# EAGLE design 3x_74HC595 (EAGLE 6.3)
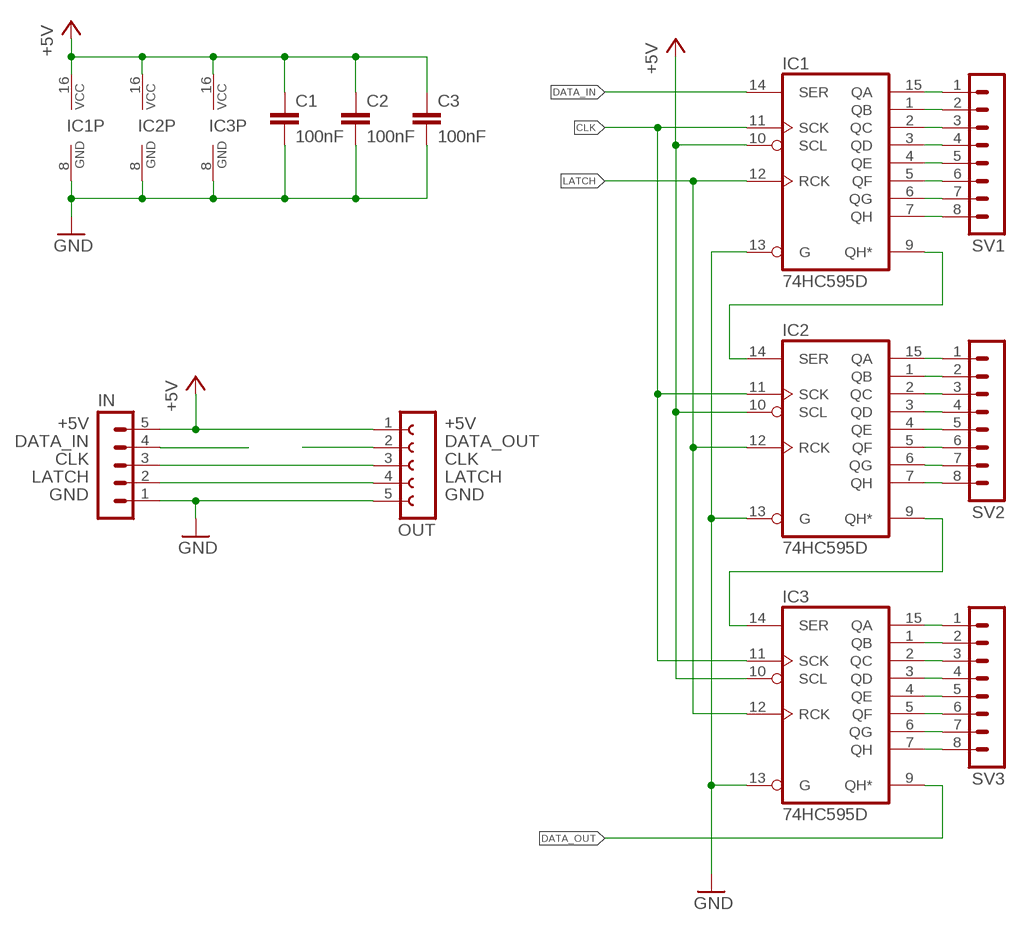
[diagram p0: schematic, sheet 1]

## Parts
C1  100nF  C-EUC1206  [C1206]
C2  100nF  C-EUC1206  [C1206]
C3  100nF  C-EUC1206  [C1206]
IC1  74HC595D  [SO16]
IC2  74HC595D  [SO16]
IC3  74HC595D  [SO16]
IN  MA05-1W  [MA05-1W]
OUT  FE05W  [FE05W]
SV1  MA08-1W  [MA08-1W]
SV2  MA08-1W  [MA08-1W]
SV3  MA08-1W  [MA08-1W]

## Nets
1QA: IC1.15(QA) SV1.1
1QB: IC1.1(QB) SV1.2
1QC: IC1.2(QC) SV1.3
1QD: IC1.3(QD) SV1.4
1QE: IC1.4(QE) SV1.5
1QF: IC1.5(QF) SV1.6
1QG: IC1.6(QG) SV1.7
1QH: IC1.7(QH) SV1.8
1SHIFTOUT: IC1.9(QH*) IC2.14(SER)
2QA: IC2.15(QA) SV2.1
2QB: IC2.1(QB) SV2.2
2QC: IC2.2(QC) SV2.3
2QD: IC2.3(QD) SV2.4
2QE: IC2.4(QE) SV2.5
2QF: IC2.5(QF) SV2.6
2QG: IC2.6(QG) SV2.7
2QH: IC2.7(QH) SV2.8
2SHIFTOUT: IC2.9(QH*) IC3.14(SER)
3QA: IC3.15(QA) SV3.1
3QB: IC3.1(QB) SV3.2
3QC: IC3.2(QC) SV3.3
3QD: IC3.3(QD) SV3.4
3QE: IC3.4(QE) SV3.5
3QF: IC3.5(QF) SV3.6
3QG: IC3.6(QG) SV3.7
3QH: IC3.7(QH) SV3.8
+5V: C1.1 C2.1 C3.1 IC1.10(SCL) IC1.16(VCC) IC2.10(SCL) IC2.16(VCC) IC3.10(SCL) IC3.16(VCC) IN.5 OUT.1
CLK: IC1.11(SCK) IC2.11(SCK) IC3.11(SCK) IN.3 OUT.3
DATA_IN: IC1.14(SER) IN.4
DATA_OUT: IC3.9(QH*) OUT.2
GND: C1.2 C2.2 C3.2 IC1.8(GND) IC1.13(G) IC2.8(GND) IC2.13(G) IC3.8(GND) IC3.13(G) IN.1 OUT.5
LATCH: IC1.12(RCK) IC2.12(RCK) IC3.12(RCK) IN.2 OUT.4

## Notes on the sheet
- +5V | +5V
- DATA_IN | DATA_OUT
- CLK | CLK
- LATCH | LATCH
- GND | GND

## Library data of the parts
C1-C3 = rcl:C-EU: CAPACITOR, European symbol
IC1-IC3 = 74xx-eu:74*595: 8-bit SHIFT REGISTER, output latch
IN = con-lstb:MA05-1W
OUT = con-lsta:FE05W: FEMALE HEADER; OC_FARNELL: unknown; OC_NEWARK: unknown
SV1-SV3 = con-lstb:MA08-1W: PIN HEADER; OC_FARNELL: unknown; OC_NEWARK: unknown

## Board
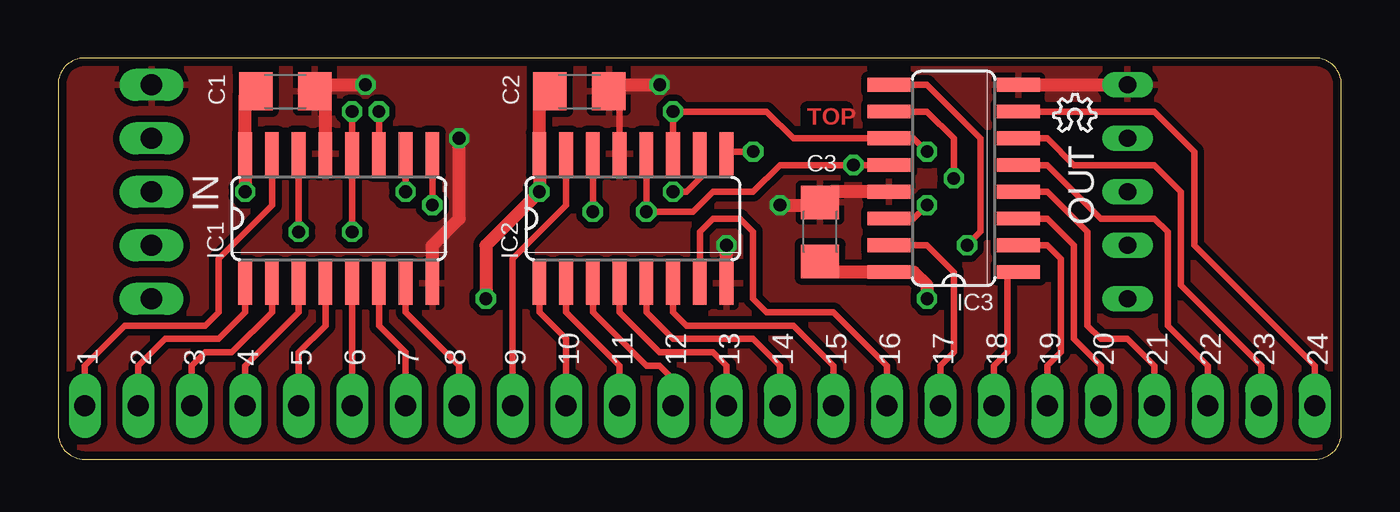
[diagram p1: board, top side]
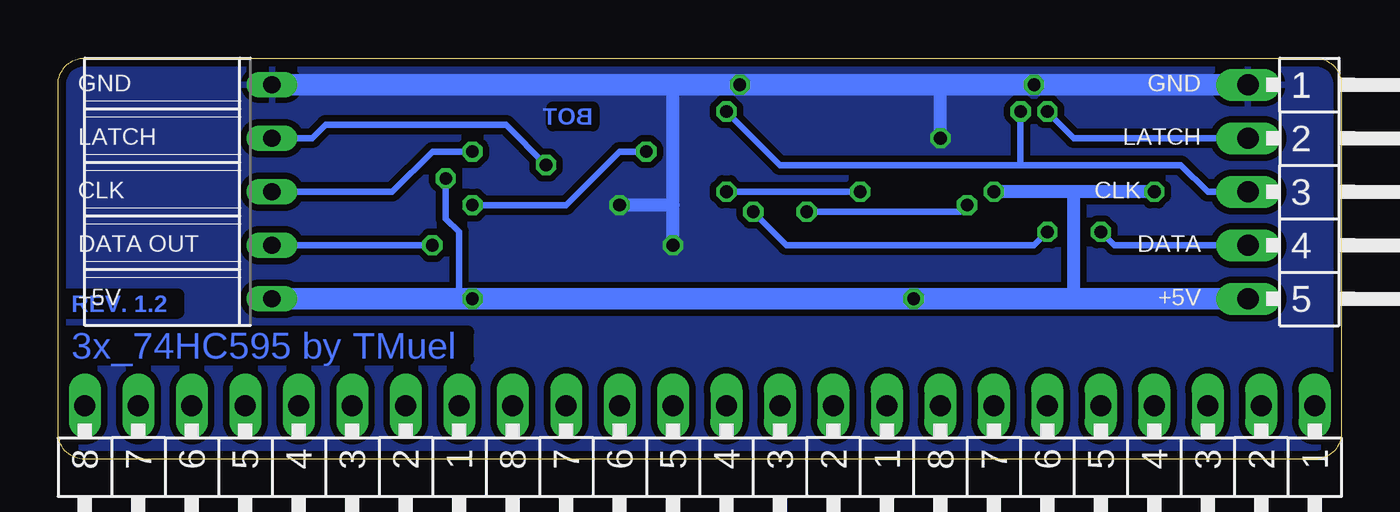
[diagram p2: board, bottom side, seen from below]

Size 60.96 x 19.05 mm. Coordinates in mm from the lower left corner, seen from the top.
Outline: 0,17.78 0,1.27 arc90 1.27,0 59.69,0 arc90 60.96,1.27 60.96,17.78 arc90 59.69,19.05 1.27,19.05 arc90 0,17.78
Copper layers (1*16): Top 0.0356mm / dielectric 1.5011mm / Bottom 0.0356mm
Design rules "LaenPCBOrder": minimum track width 6mil, minimum drill 13mil, track to track 6mil, track to pad 6mil, pad to pad 6mil, via to via 6mil, smd to smd 6mil, copper to edge 15mil, drill to drill 6mil, minimum pad ring 7mil, minimum via ring 7mil, stop-mask expansion 3mil, vias tented up to drill 0mil, thermal gap 10mil

### Footprints (pad centres in the part's own frame; a part is rotated, then mirrored left to right if it is on the bottom)
C1206 = smd 1.6 x 1.8: 1 -1.4,0; 2 1.4,0
SO16 = smd 0.66 x 2.032: 1 -4.445,-3.073; 2 -3.175,-3.073; 3 -1.905,-3.073; 4 -0.635,-3.073; 5 0.635,-3.073; 6 1.905,-3.073; 7 3.175,-3.073; 8 4.445,-3.073; 9 4.445,3.073; 10 3.175,3.073; 11 1.905,3.073; 12 0.635,3.073; 13 -0.635,3.073; 14 -1.905,3.073; 15 -3.175,3.073; 16 -4.445,3.073
MA05-1W = drill 1.016 long: 1 -5.08,0; 2 -2.54,0; 3 0,0; 4 2.54,0; 5 5.08,0
FE05W = drill 0.813 long: 1 -5.08,0; 2 -2.54,0; 3 0,0; 4 2.54,0; 5 5.08,0
MA08-1W = drill 1.016 long: 1 -8.89,0; 2 -6.35,0; 3 -3.81,0; 4 -1.27,0; 5 1.27,0; 6 3.81,0; 7 6.35,0; 8 8.89,0

### Placement (x,y rotation side)
C1  10.79,17.46 0 top
C2  24.77,17.46 0 top
C3  36.2,10.79 90 top
IC1  13.34,11.43 0 top
IC2  27.3,11.43 0 top
IC3  42.55,13.34 90 top
IN  4.45,12.7 270 bottom
OUT  50.8,12.7 90 bottom
SV1  10.16,2.54 180 bottom
SV2  30.48,2.54 180 bottom
SV3  50.8,2.54 180 bottom
U$1  [OSHW_6X70_NOTEXT]  47.31,15.56 0 top

### Tracks (layer width: path | path; a pad name or v marks a point on that pad's centre or on a via)
1QA
  Top 0.305: IC1.15 10.16,12.06 7.62,9.53 7.62,6.99 6.99,6.35 3.17,6.35 1.27,4.45 SV1.1
1QB
  Top 0.305: IC1.1 8.89,6.99 7.62,5.71 5.08,5.71 3.81,4.45 SV1.2
1QC
  Top 0.305: IC1.2 10.16,6.99 8.26,5.08 6.99,5.08 6.35,4.45 SV1.3
1QD
  Top 0.305: IC1.3 11.43,6.99 8.89,4.45 SV1.4
1QE
  Top 0.305: IC1.4 12.7,6.35 11.43,5.08 SV1.5
1QF
  Top 0.305: IC1.5 SV1.6
1QG
  Top 0.305: SV1.7 16.51,5.08 15.24,6.35 IC1.6
1QH
  Top 0.305: IC1.7 16.51,6.99 19.05,4.45 SV1.8
1SHIFTOUT  (via drill 0.6)
  Top 0.305: IC2.14 v25.4,11.75 | v17.78,12.06 IC1.9
  Bottom 0.305: v25.4,11.75 18.1,11.75 v17.78,12.06
2QA
  Top 0.305: IC2.15 24.13,12.06 21.59,9.53 SV2.1
2QB
  Top 0.305: SV2.2 24.13,5.71 22.86,6.99 IC2.1
2QC
  Top 0.305: SV2.3 26.67,4.45 24.13,6.99 IC2.2
2QD
  Top 0.305: SV2.4 29.21,3.81 28.57,4.45 27.94,4.45 25.4,6.99 IC2.3
2QE
  Top 0.305: SV2.5 31.75,4.45 31.11,5.08 28.57,5.08 26.67,6.99 IC2.4
2QF
  Top 0.305: SV2.6 34.29,4.45 33.02,5.71 29.21,5.71 27.94,6.99 IC2.5
2QG
  Top 0.305: SV2.7 36.83,4.45 34.92,6.35 29.84,6.35 29.21,6.99 IC2.6
2QH
  Top 0.305: IC2.7 30.48,10.79 31.11,11.43 32.38,11.43 33.02,10.79 33.02,7.62 33.66,6.99 36.83,6.99 39.37,4.45 SV2.8
2SHIFTOUT  (via drill 0.6)
  Top 0.305: IC3.14 40.64,11.43 v41.27,12.06 | v33.02,14.61 31.75,14.61 IC2.9
  Bottom 0.305: v41.27,12.06 36.83,12.06 34.29,14.61 v33.02,14.61
3QA
  Top 0.305: SV3.1 41.91,4.45 42.55,5.08 42.55,8.89 41.27,10.16 IC3.15
3QB
  Top 0.305: 45.72,8.89 IC3.1 45.09,8.89 45.09,5.08 44.45,4.45 SV3.2
3QC
  Top 0.305: SV3.3 46.99,4.45 47.62,5.08 47.62,9.53 46.99,10.16 IC3.2
3QD
  Top 0.305: SV3.4 49.53,4.45 48.26,5.71 48.26,10.16 46.99,11.43 IC3.3
3QE
  Top 0.305: SV3.5 52.07,4.45 50.8,5.71 49.53,5.71 48.9,6.35 48.9,10.79 46.99,12.7 IC3.4
3QF
  Top 0.305: SV3.6 54.61,4.45 52.7,6.35 52.7,10.79 52.07,11.43 49.53,11.43 46.99,13.97 IC3.5
3QG
  Top 0.305: SV3.7 57.15,4.45 53.34,8.26 53.34,12.7 52.07,13.97 48.26,13.97 46.99,15.24 IC3.6
3QH
  Top 0.305: SV3.8 59.69,4.45 53.98,10.16 53.98,14.61 52.07,16.51 IC3.7
+5V  (via drill 0.6)
  Top 0.305: IC1.10 v16.51,12.7 | IC2.10 30.48,13.34 29.84,12.7 v29.21,12.7 | 36.7,8.89 C3.1 | 8.89,17.27 C1.1 | 22.86,17.27 C2.1 | v42.55,13.34 42.55,15.24 41.27,16.51 IC3.10 39.37,16.51
  Top 0.61: v8.89,12.7 IC1.16 8.89,17.27 | 36.7,8.89 IC3.16 40.64,8.89 41.27,8.26 v41.27,7.62 | 22.86,17.27 IC2.16 v22.86,12.7 20.32,10.16 v20.32,7.62
  Bottom 0.305: v29.21,12.7 v22.86,12.7 | v42.55,13.34 42.55,11.43 41.91,10.79 41.91,7.62
  Bottom 0.61: v8.89,12.7 12.7,12.7 | 12.7,12.7 v16.51,12.7 | 12.7,7.62 12.7,12.7
  Bottom 1.016: OUT.1 41.91,7.62 v41.27,7.62 v20.32,7.62 12.7,7.62 IN.5
CLK  (via drill 0.6)
  Top 0.305: IC1.11 v15.24,16.51 | IC2.11 v29.21,16.51 33.66,16.51 34.92,15.24 IC3.11 40.64,15.24 v41.27,14.61
  Bottom 0.305: 15.24,13.97 26.67,13.97 v29.21,16.51 | IN.3 6.35,12.7 7.62,13.97 15.24,13.97 | 15.24,13.97 v15.24,16.51 | OUT.3 45.09,12.7 43.18,14.61 v41.27,14.61
DATA_IN  (via drill 0.6)
  Top 0.305: IC1.14 v11.43,10.79
  Bottom 0.305: v11.43,10.79 10.79,10.16 IN.4
DATA_OUT  (via drill 0.6)
  Top 0.305: IC3.9 41.27,17.78 43.81,15.24 43.81,10.79 v43.18,10.16
  Bottom 0.305: v43.18,10.16 OUT.2
GND  (via drill 0.6)
  Top 0.305: 36.7,12.7 C3.2 36.06,12.06 | 12.7,17.27 C1.2 | IC2.13 26.67,17.27 | 26.67,17.27 C2.2 | 26.67,17.27 26.67,17.78
  Top 0.61: IC3.13 36.7,12.7 | IC1.13 12.7,17.27 | IC3.8 OUT.5 | IC2.8 v31.75,10.16 | C1.2 12.38,17.78 v14.61,17.78 | 26.67,17.78 v28.57,17.78 | IC1.8 17.78,10.16 19.05,11.43 v19.05,15.24 | v34.29,12.06 36.06,12.06
  Bottom 0.61: 31.75,12.06 31.75,17.78 | v19.05,15.24 19.05,17.78 | v31.75,10.16 31.75,12.06 | 31.75,12.06 v34.29,12.06
  Bottom 1.016: OUT.5 31.75,17.78 v28.57,17.78 19.05,17.78 v14.61,17.78 IN.1
  pour Top (isolate 0.305): 0,19.05 0,0 60.96,0 60.96,19.05
  pour Bottom (isolate 0.305): 0,19.05 60.96,19.05 60.96,0 0,0
LATCH  (via drill 0.6)
  Top 0.305: IC2.12 v27.94,11.75 30.16,11.75 31.11,12.7 33.02,12.7 34.29,13.97 v37.78,13.97 IC3.12 | v13.97,10.79 IC1.12 v13.97,16.51
  Bottom 0.305: v27.94,11.75 26.35,10.16 14.61,10.16 v13.97,10.79 | OUT.4 48.9,15.24 48.26,15.88 39.69,15.88 v37.78,13.97 | IN.2 12.7,15.24 v13.97,16.51

### Text on the board
Top: TOP
Bottom: BOT | REV. 1.2 | 3x_74HC595 by TMuel
tPlace: 1 | 2 | 3 | 4 | 5 | 6 | 7 | 8 | 9 | 10 | 11 | 12 | 13 | 14 | 15 | 16 | 17 | 18 | 19 | 20 | 21 | 22 | 23 | 24
bNames: GND | GND | LATCH | LATCH | CLK | CLK | DATA | DATA OUT | +5V | +5V
Document: REV 1.1: / * Rounded edges for the board outline / * Labels for the IO / REV 1.2: / * Moved the OUT connector for better daisy chaining